# EAGLE design Badge_03v2-prog-schem (EAGLE 7.2.0)
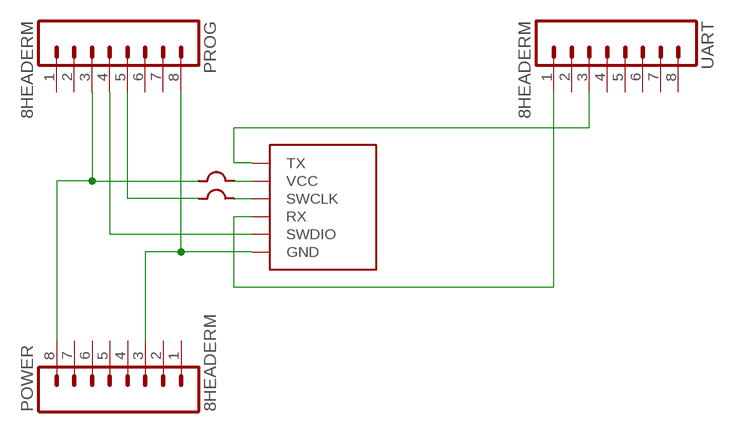
[diagram p0: schematic, sheet 1]

## Parts
J1  PROG_CONN_6  [TH_CONN_6]
POWER  8HEADERM  [1X08_ROUND]
PROG  8HEADERM  [1X08_ROUND]
U$1  JUMPER  [1206]
U$2  JUMPER  [1206]
UART  8HEADERM  [1X08_ROUND]

## Nets
GND: J1.GND POWER.3 PROG.8
N$1: J1.VCC U$1.2
N$2: J1.SWCLK U$2.2
N$5: J1.SWDIO PROG.4
RX: J1.RX UART.1
SWCLK: PROG.5 U$2.1
TX: J1.TX UART.3
VCC: POWER.8 PROG.3 U$1.1
Unconnected: POWER.1 POWER.2 POWER.4 POWER.5 POWER.6 POWER.7 PROG.1 PROG.2 PROG.6 PROG.7 UART.2 UART.4 UART.5 UART.6 UART.7 UART.8

## Library data of the parts
J1 = Badge:PROG_CONN_6
POWER PROG UART = Badge:8HEADER
U$1 U$2 = Badge:JUMPER

## Board
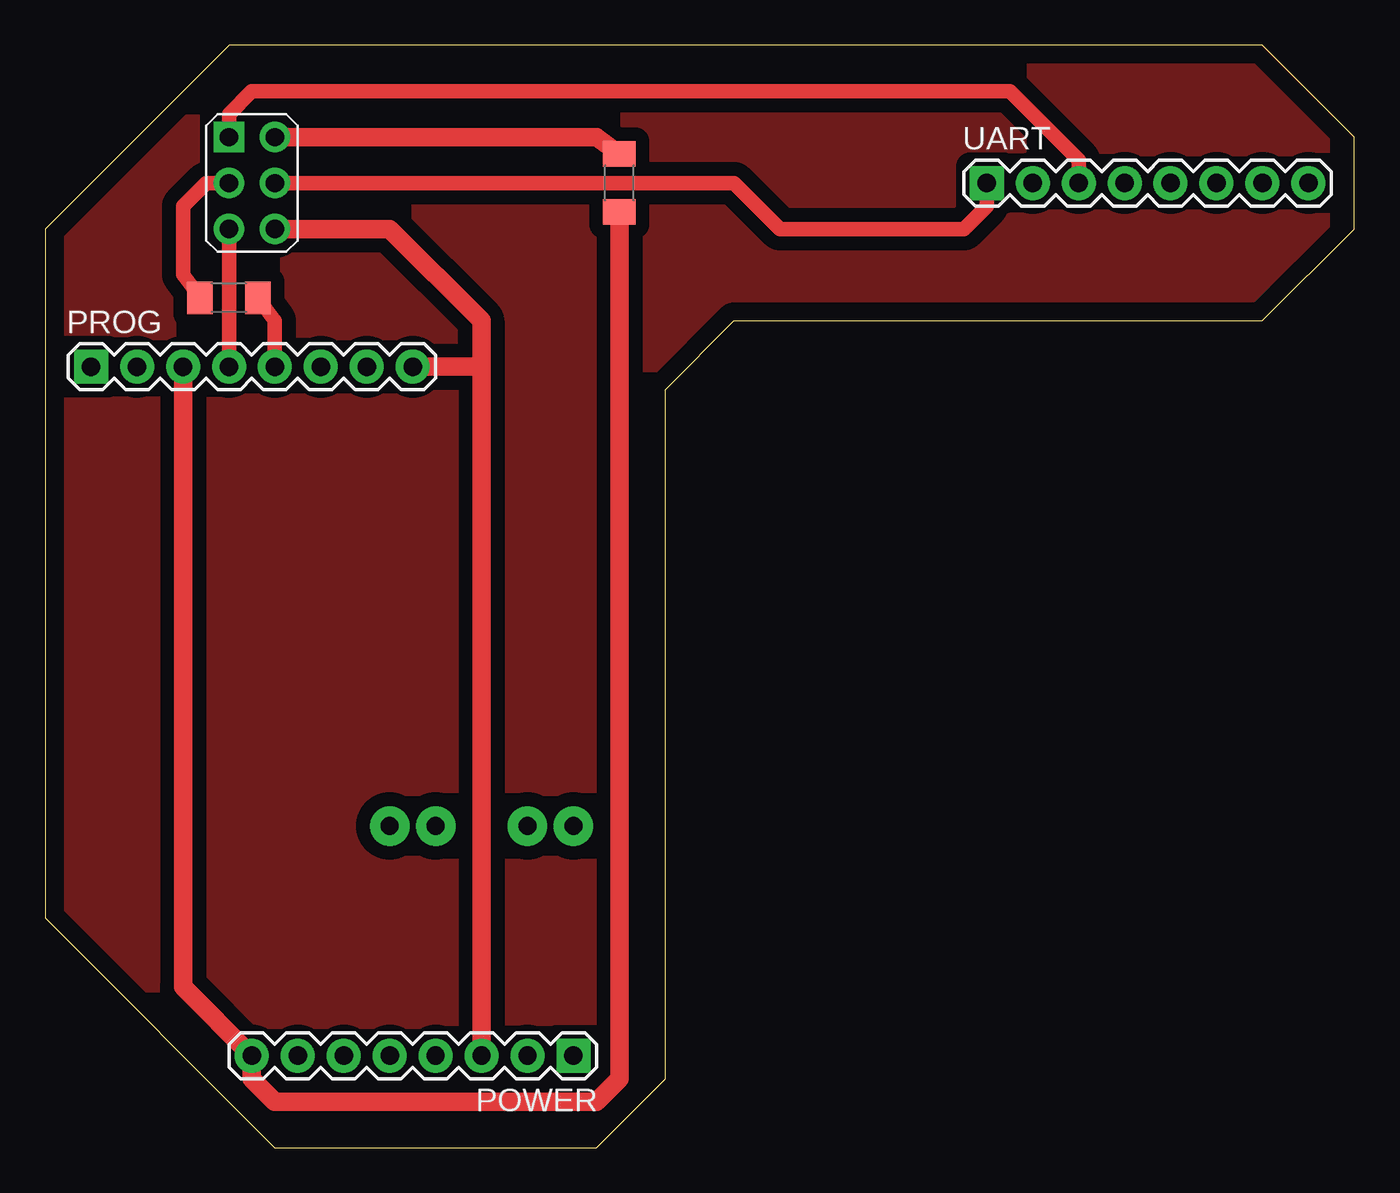
[diagram p1: board, top side]

Size 72.39 x 60.96 mm. Coordinates in mm from the lower left corner, seen from the top.
Outline: 67.31,60.96 10.16,60.96 0,50.8 0,12.7 12.7,0 30.48,0 34.29,3.81 34.29,41.91 38.1,45.72 67.31,45.72 72.39,50.8 72.39,55.88 67.31,60.96
Copper layers (1*16): Top 0.035mm / dielectric 1.5mm / Bottom 0.035mm
Design rules "default": minimum track width 10mil, minimum drill 24mil, track to track 8mil, track to pad 8mil, pad to pad 8mil, via to via 8mil, smd to smd 8mil, copper to edge 40mil, drill to drill 8mil, minimum pad ring 10mil, minimum via ring 8mil, stop-mask expansion 4mil, vias tented up to drill 0mil, thermal gap 10mil

### Footprints (pad centres in the part's own frame; a part is rotated, then mirrored left to right if it is on the bottom)
TH_CONN_6 = drill 1 pad 1.676: GND 1.27,-2.54; RX 1.27,0; SWCLK -1.27,0; SWDIO -1.27,-2.54; VCC 1.27,2.54 | drill 1 pad 1.676 square: TX -1.27,2.54
1X08_ROUND = drill 1.016 pad 1.88 square: 1 0,0 | drill 1.016 pad 1.88: 2 2.54,0; 3 5.08,0; 4 7.62,0; 5 10.16,0; 6 12.7,0; 7 15.24,0; 8 17.78,0
1206 = smd 1.4 x 1.8: 1 -1.6,0; 2 1.6,0

### Placement (x,y rotation side)
J1  11.43,53.34 0 top
POWER  29.21,5.08 180 top
PROG  2.54,43.18 0 top
U$1  31.75,53.34 90 top
U$2  10.16,46.99 180 top
UART  52.07,53.34 0 top

### Tracks (layer width: path | path; a pad name or v marks a point on that pad's centre or on a via)
GND
  Top 1.016: PROG.8 24.13,43.18 | 24.13,43.18 POWER.3 | J1.GND 19.05,50.8 24.13,45.72 24.13,43.18
N$1
  Top 1.016: J1.VCC 30.48,55.88 U$1.2
N$2
  Top 0.813: U$2.2 7.62,48.26 7.62,52.07 8.89,53.34 J1.SWCLK
N$3  (via drill 1 pad 2.18)
  other vias: 29.21,17.78
N$4  (via drill 1 pad 2.18)
  other vias: 26.67,17.78
N$5
  Top 0.813: J1.SWDIO PROG.4
N$6  (via drill 1 pad 2.18)
  other vias: 21.59,17.78
N$7  (via drill 1 pad 2.18)
  other vias: 19.05,17.78
N$8
  pour Top (isolate 0.762): 10.16,60.96 0,50.8 0,12.7 12.7,0 30.48,0 34.29,3.81 34.29,41.91 38.1,45.72 67.31,45.72 72.39,50.8 72.39,55.88 67.31,60.96
RX
  Top 0.813: J1.RX 38.1,53.34 40.64,50.8 50.8,50.8 52.07,52.07 UART.1
SWCLK
  Top 0.813: PROG.5 12.7,45.72 U$2.1
TX
  Top 0.813: J1.TX 10.16,57.15 11.43,58.42 53.34,58.42 57.15,54.61 UART.3
VCC
  Top 1.016: PROG.3 7.62,8.89 POWER.8 11.43,3.81 12.7,2.54 30.48,2.54 31.75,3.81 U$1.1